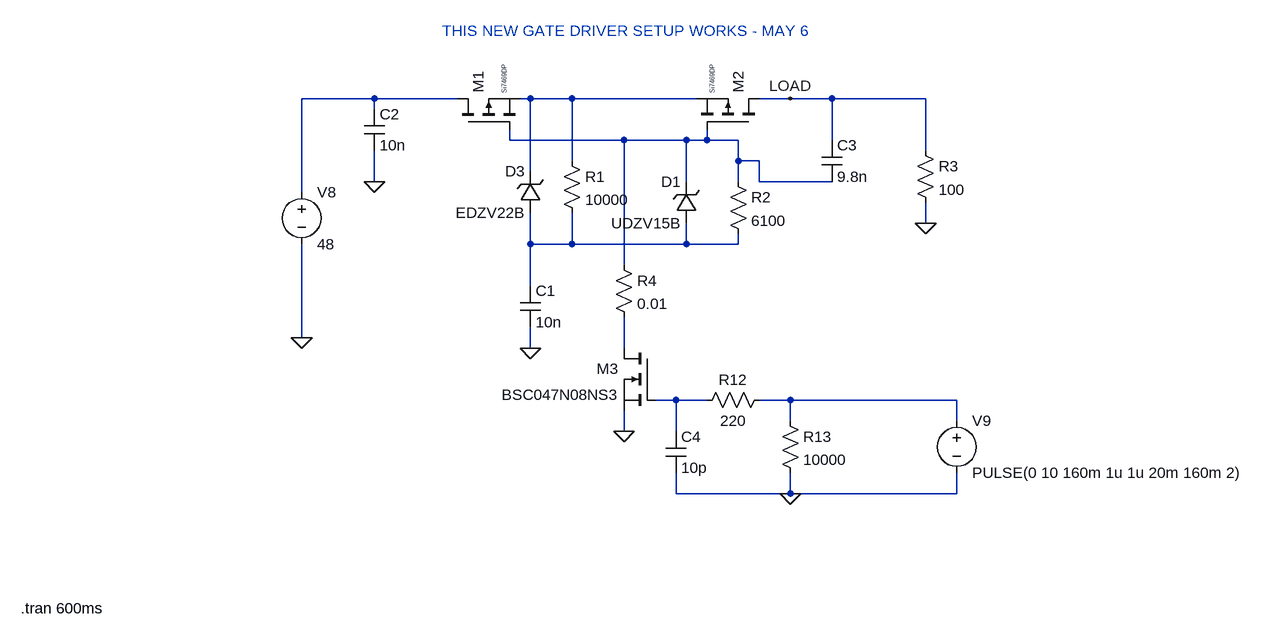
[diagram p0: schematic PMOS Bidirectional Switch Prototype 6.asc]
PMOS Bidirectional Switch Prototype 6.asc, the LTspice schematic file:
Version 4.1
SHEET 1 2720 2516
WIRE -736 400 -848 400
WIRE -608 400 -736 400
WIRE -496 400 -512 400
WIRE -432 400 -496 400
WIRE -240 400 -432 400
WIRE -96 400 -144 400
WIRE -32 400 -96 400
WIRE 112 400 -32 400
WIRE -736 416 -736 400
WIRE -528 464 -528 448
WIRE -352 464 -528 464
WIRE -256 464 -352 464
WIRE -224 464 -224 448
WIRE -224 464 -256 464
WIRE -176 464 -224 464
WIRE -32 464 -32 400
WIRE 112 480 112 400
WIRE -432 496 -432 400
WIRE -176 496 -176 464
WIRE -144 496 -176 496
WIRE -496 512 -496 400
WIRE -736 528 -736 480
WIRE -256 528 -256 464
WIRE -176 528 -176 496
WIRE -144 528 -144 496
WIRE -32 528 -144 528
WIRE -848 544 -848 400
WIRE 112 592 112 560
WIRE -496 624 -496 576
WIRE -432 624 -432 576
WIRE -432 624 -496 624
WIRE -256 624 -256 592
WIRE -256 624 -432 624
WIRE -176 624 -176 608
WIRE -176 624 -256 624
WIRE -352 656 -352 464
WIRE -496 688 -496 624
WIRE -848 768 -848 624
WIRE -496 784 -496 752
WIRE -352 784 -352 736
WIRE -272 864 -304 864
WIRE -224 864 -272 864
WIRE -96 864 -144 864
WIRE 160 864 -96 864
WIRE -96 896 -96 864
WIRE 160 896 160 864
WIRE -352 912 -352 880
WIRE -272 912 -272 864
WIRE -272 1008 -272 976
WIRE -96 1008 -96 976
WIRE -96 1008 -272 1008
WIRE 160 1008 160 976
WIRE 160 1008 -96 1008
FLAG -848 768 0
FLAG -352 912 0
FLAG -96 1008 0
FLAG -96 400 LOAD
FLAG -736 528 0
FLAG -496 784 0
FLAG 112 592 0
SYMBOL voltage -848 528 R0
WINDOW 123 0 0 Left 0
WINDOW 39 24 124 Left 2
SYMATTR InstName V8
SYMATTR Value 48
SYMBOL voltage 160 880 R0
WINDOW 123 0 0 Left 0
WINDOW 39 0 0 Left 0
SYMATTR InstName V9
SYMATTR Value PULSE(0 10 160m 1u 1u 20m 160m 2)
SYMBOL res -128 848 R90
WINDOW 0 0 56 VBottom 2
WINDOW 3 32 56 VTop 2
SYMATTR InstName R12
SYMATTR Value 220
SYMBOL res -112 880 R0
SYMATTR InstName R13
SYMATTR Value 10000
SYMBOL cap -288 912 R0
SYMATTR InstName C4
SYMATTR Value 10p
SYMBOL zener -480 576 R180
WINDOW 0 24 64 Left 2
WINDOW 3 24 0 Left 2
SYMATTR InstName D3
SYMATTR Value EDZV22B
SYMBOL pmos -608 448 R270
WINDOW 3 56 72 Left 0
SYMATTR Value Si7469DP
SYMATTR InstName M1
SYMBOL pmos -144 448 M270
WINDOW 3 56 72 Left 0
SYMATTR Value Si7469DP
SYMATTR InstName M2
SYMBOL nmos -304 784 M0
SYMATTR InstName M3
SYMATTR Value BSC047N08NS3
SYMBOL cap -752 416 R0
SYMATTR InstName C2
SYMATTR Value 10n
SYMBOL res -448 480 R0
SYMATTR InstName R1
SYMATTR Value 10000
SYMBOL cap -512 688 R0
SYMATTR InstName C1
SYMATTR Value 10n
SYMBOL zener -240 592 R180
WINDOW 0 24 64 Left 2
WINDOW 3 24 0 Left 2
SYMATTR InstName D1
SYMATTR Value UDZV15B
SYMBOL res -192 512 R0
SYMATTR InstName R2
SYMATTR Value 6100
SYMBOL cap -48 464 R0
SYMATTR InstName C3
SYMATTR Value 9.8n
SYMBOL res 96 464 R0
SYMATTR InstName R3
SYMATTR Value 100
SYMBOL res -368 640 R0
SYMATTR InstName R4
SYMATTR Value 0.01
TEXT -632 296 Left 2 ;THIS NEW GATE DRIVER SETUP WORKS - MAY 6
TEXT -1280 1184 Left 2 !.tran 600ms

The netlist it stands for:
* PMOS Bidirectional Switch Prototype 6.asc
V8 N001 0 48
V9 N007 0 PULSE(0 10 160m 1u 1u 20m 160m 2)
R12 N007 N006 220
R13 N007 0 10000
C4 N006 0 10p
D3 N004 N002 EDZV22B
M1 N001 N003 N002 N002 Si7469DP
M2 LOAD N003 N002 N002 Si7469DP
M3 N005 N006 0 0 BSC047N08NS3
C2 N001 0 10n
R1 N002 N004 10000
C1 N004 0 10n
D1 N004 N003 UDZV15B
R2 N003 N004 6100
C3 LOAD N003 9.8n
R3 LOAD 0 100
R4 N003 N005 0.01
.model D D
.lib standard.dio
.model NMOS NMOS
.model PMOS PMOS
.lib standard.mos
* THIS NEW GATE DRIVER SETUP WORKS - MAY 6
.tran 600ms
.backanno
.end